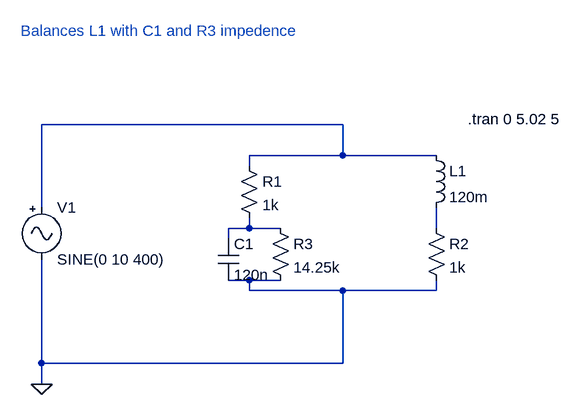
[diagram p0: schematic Bridge_advance_balance.asc]
Bridge_advance_balance.asc, the LTspice schematic file:
Version 4.1
SHEET 1 924 680
WIRE 544 32 80 32
WIRE 544 80 544 32
WIRE 544 80 400 80
WIRE 688 80 544 80
WIRE 400 96 400 80
WIRE 80 160 80 32
WIRE 400 192 400 176
WIRE 400 192 368 192
WIRE 448 192 400 192
WIRE 688 192 688 160
WIRE 368 208 368 192
WIRE 400 272 368 272
WIRE 448 272 400 272
WIRE 400 288 400 272
WIRE 544 288 400 288
WIRE 688 288 688 272
WIRE 688 288 544 288
WIRE 80 400 80 240
WIRE 544 400 544 288
WIRE 544 400 80 400
WIRE 80 432 80 400
FLAG 80 432 0
SYMBOL Misc\\signal 80 144 R0
WINDOW 123 0 0 Left 0
WINDOW 39 0 0 Left 0
SYMATTR InstName V1
SYMATTR Value SINE(0 10 400)
SYMBOL ind 672 64 R0
SYMATTR InstName L1
SYMATTR Value 120m
SYMATTR SpiceLine Rser=70.175
SYMBOL cap 352 208 R0
SYMATTR InstName C1
SYMATTR Value 120n
SYMBOL res 384 80 R0
SYMATTR InstName R1
SYMATTR Value 1k
SYMBOL res 672 176 R0
SYMATTR InstName R2
SYMATTR Value 1k
SYMBOL res 432 176 R0
SYMATTR InstName R3
SYMATTR Value 14.25k
TEXT 736 24 Left 2 !.tran 0 5.02 5
TEXT 48 -112 Left 2 ;Balances L1 with C1 and R3 impedence

The netlist it stands for:
* Bridge_advance_balance.asc
V1 N001 0 SINE(0 10 400)
L1 N001 N003 120m Rser=70.175
C1 N002 0 120n
R1 N001 N002 1k
R2 N003 0 1k
R3 N002 0 14.25k
.tran 0 5.02 5
* Balances L1 with C1 and R3 impedence
.backanno
.end